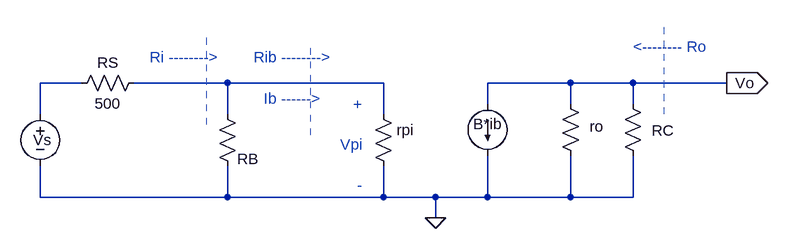
[diagram p0: schematic exer6_07_AC_small-signal.asc]
exer6_07_AC_small-signal.asc, the LTspice schematic file:
Version 4
SHEET 1 1292 680
WIRE 64 96 0 96
WIRE 288 96 144 96
WIRE 528 96 288 96
WIRE 816 96 688 96
WIRE 912 96 816 96
WIRE 1056 96 912 96
WIRE 688 128 688 96
WIRE 816 128 816 96
WIRE 912 128 912 96
WIRE 0 144 0 96
WIRE 288 144 288 96
WIRE 528 144 528 96
WIRE 0 272 0 224
WIRE 288 272 288 224
WIRE 288 272 0 272
WIRE 528 272 528 224
WIRE 528 272 288 272
WIRE 608 272 528 272
WIRE 688 272 688 208
WIRE 688 272 608 272
WIRE 816 272 816 208
WIRE 816 272 688 272
WIRE 912 272 912 208
WIRE 912 272 816 272
WIRE 608 304 608 272
FLAG 608 304 0
FLAG 1056 96 Vo
IOPIN 1056 96 Out
SYMBOL res 272 128 R0
WINDOW 0 31 85 Left 2
SYMATTR InstName RB
SYMATTR Value ""
SYMBOL res 512 128 R0
SYMATTR InstName rpi
SYMATTR Value ""
SYMBOL current 688 128 R0
WINDOW 0 -22 31 Left 2
SYMATTR InstName B*ib
SYMATTR Value ""
SYMBOL voltage 0 128 R0
WINDOW 0 -11 56 Left 2
SYMATTR InstName Vs
SYMATTR Value ""
SYMBOL res 896 112 R0
WINDOW 0 45 57 Left 2
SYMATTR InstName RC
SYMATTR Value ""
SYMBOL res 800 112 R0
WINDOW 0 45 51 Left 2
SYMATTR InstName ro
SYMATTR Value ""
SYMBOL res 160 80 R90
WINDOW 0 0 56 VBottom 2
WINDOW 3 32 56 VTop 2
SYMATTR InstName RS
SYMATTR Value 500
TEXT 328 56 Left 2 ;Rib -------->
TEXT 168 56 Left 2 ;Ri -------->
TEXT 912 40 Left 2 ;<-------- Ro
TEXT 344 120 Left 2 ;Ib ------>
TEXT 496 128 Right 2 ;+\n \nVpi\n \n-
LINE Normal 416 176 416 32 2
LINE Normal 256 160 256 16 2
LINE Normal 960 144 960 0 2

The netlist it stands for:
* exer6_07_AC_small-signal.asc
RB N002 0
rpi N002 0
I§B*ib Vo 0
Vs N001 0
RC Vo 0
ro Vo 0
RS N002 N001 500
* Rib -------->
* Ri -------->
* <-------- Ro
* Ib ------>
* +
* Vpi
* -
.backanno
.end